# Altium schematic sheet STB_LightBoard.SchDoc: STB Light Board
size A3; Author: mayerph; DrawnBy: mayerph; Organization: PBL; Revision: A; SheetNumber: 1; SheetTotal: 21
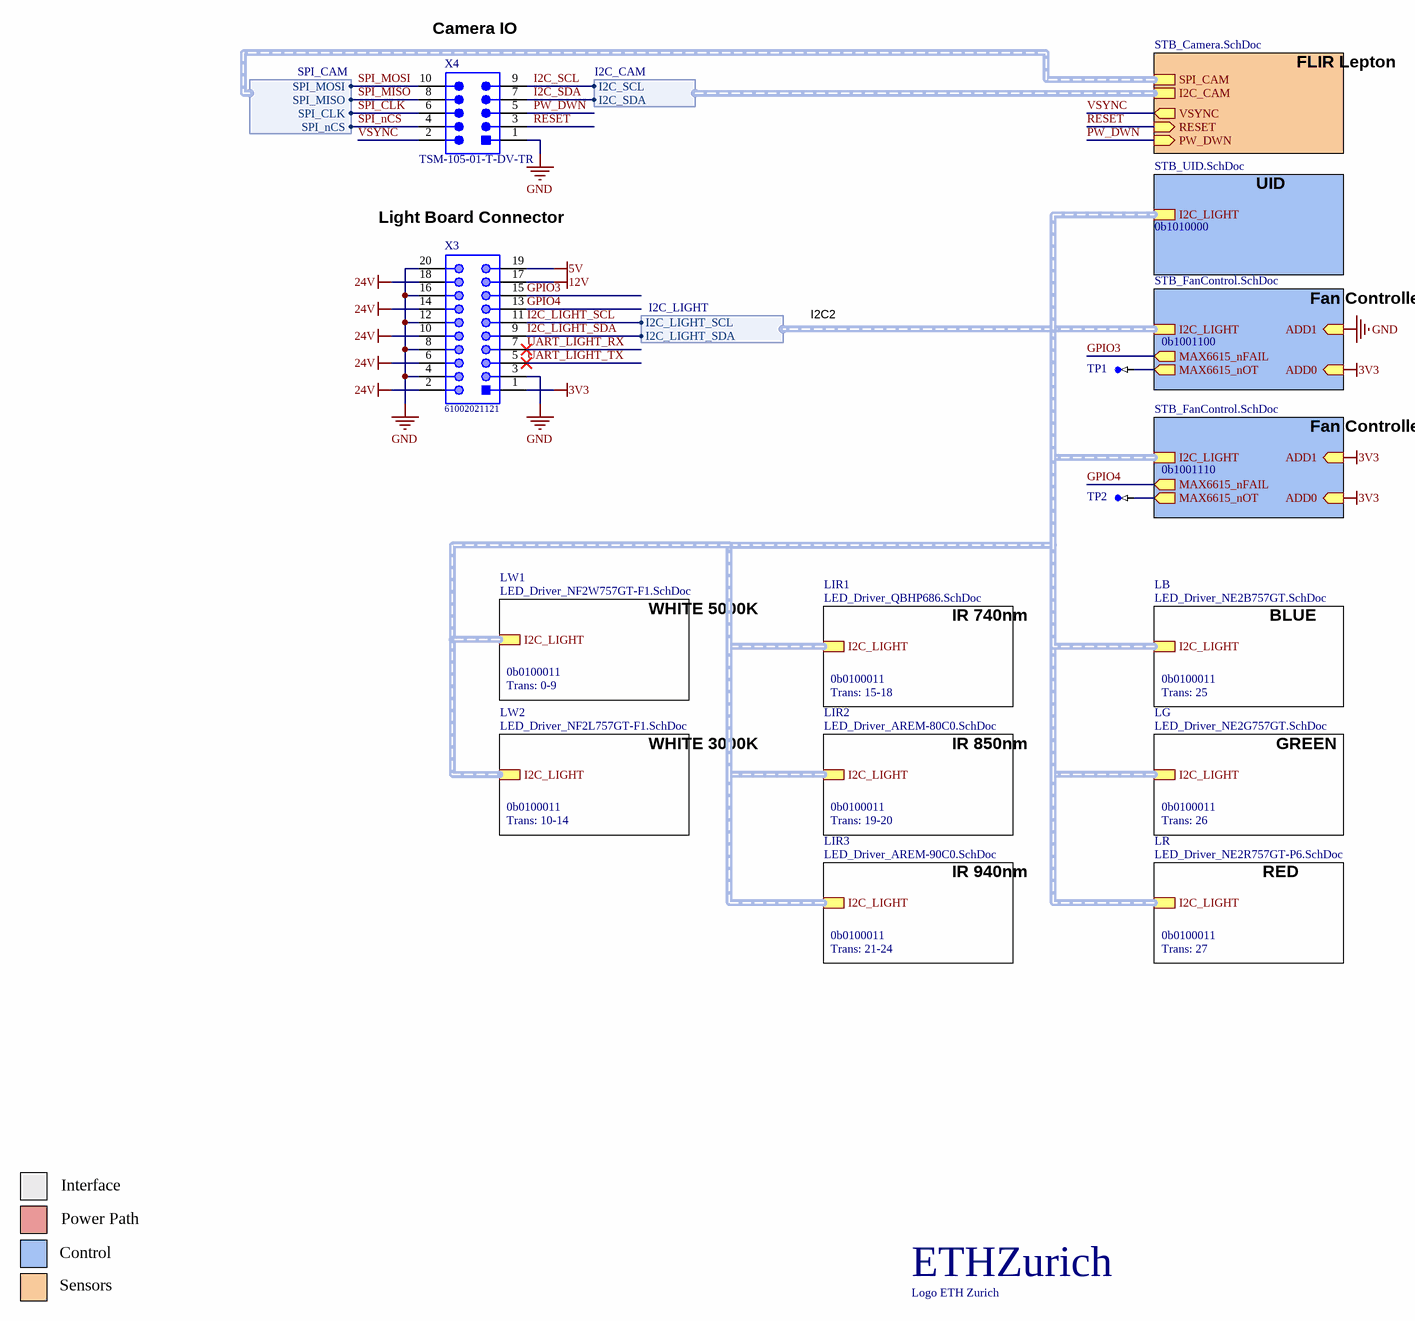
[diagram p0: STB_LightBoard.SchDoc]

## Parts
A1  Logo ETH Zurich  [eth-zurich_5mm]  (no BOM)
TP1  testPoint_1mm  [TP-SM-C-100]  (value not drawn)  (no BOM)
TP2  testPoint_1mm  [TP-SM-C-100]  (value not drawn)  (no BOM)
X3  61002021121  [61002021121]
X4  TSM-105-01-T-DV-TR  [SMTC-TSM-105-01-T-DV_V]

## Sub-sheets
FLIR = STB_Camera.SchDoc: PW_DWN (in), RESET (in), VSYNC (out), I2C_CAM (harness I2C_CAM), SPI_CAM (harness SPI_CAM)
LB = LED_Driver_NE2B757GT.SchDoc: I2C_LIGHT (harness I2C_LIGHT)
LG = LED_Driver_NE2G757GT.SchDoc: I2C_LIGHT (harness I2C_LIGHT)
LIR1 = LED_Driver_QBHP686.SchDoc: I2C_LIGHT (harness I2C_LIGHT)
LIR2 = LED_Driver_AREM-80C0.SchDoc: I2C_LIGHT (harness I2C_LIGHT)
LIR3 = LED_Driver_AREM-90C0.SchDoc: I2C_LIGHT (harness I2C_LIGHT)
LR = LED_Driver_NE2R757GT-P6.SchDoc: I2C_LIGHT (harness I2C_LIGHT)
LW1 = LED_Driver_NF2W757GT-F1.SchDoc: I2C_LIGHT (harness I2C_LIGHT)
LW2 = LED_Driver_NF2L757GT-F1.SchDoc: I2C_LIGHT (harness I2C_LIGHT)
TC1 = STB_FanControl.SchDoc: MAX6615_nOT (out), MAX6615_nFAIL (out), I2C_LIGHT (harness I2C_LIGHT), ADD1 (in), ADD0 (in)
TC2 = STB_FanControl.SchDoc: MAX6615_nOT (out), MAX6615_nFAIL (out), I2C_LIGHT (harness I2C_LIGHT), ADD1 (in), ADD0 (in)
UID = STB_UID.SchDoc: I2C_LIGHT (harness I2C_LIGHT)

## Harnesses
I2C_LIGHT: I2C_LIGHT_SDA, I2C_LIGHT_SCL
I2C_CAM: I2C_SDA, I2C_SCL
SPI_CAM: SPI_MISO, SPI_MOSI, SPI_CLK, SPI_nCS

## Nets
3V3: X3.1 ; sheet TC1/ADD0, sheet TC2/ADD1, sheet TC2/ADD0
5V: X3.19
12V: X3.17
24V: X3.2 X3.6 X3.10 X3.14 X3.18
GND: X3.3 X3.4 X3.8 X3.12 X3.16 X3.20 X4.1 ; sheet TC1/ADD1
GPIO3: X3.15 ; sheet TC1/MAX6615_nFAIL
GPIO4: X3.13 ; sheet TC2/MAX6615_nFAIL
I2C_LIGHT_SCL: X3.11 ; sheet UID/I2C_LIGHT.I2C_LIGHT_SCL
I2C_LIGHT_SDA: X3.9 ; sheet UID/I2C_LIGHT.I2C_LIGHT_SDA
I2C_SCL: X4.9 ; sheet FLIR/I2C_CAM.I2C_SCL
I2C_SDA: X4.7 ; sheet FLIR/I2C_CAM.I2C_SDA
PW_DWN: X4.5 ; sheet FLIR/PW_DWN
RESET: X4.3 ; sheet FLIR/RESET
SPI_CLK: X4.6 ; sheet FLIR/SPI_CAM.SPI_CLK
SPI_MISO: X4.8 ; sheet FLIR/SPI_CAM.SPI_MISO
SPI_MOSI: X4.10 ; sheet FLIR/SPI_CAM.SPI_MOSI
SPI_nCS: X4.4 ; sheet FLIR/SPI_CAM.SPI_nCS
UART_LIGHT_RX: X3.7
UART_LIGHT_TX: X3.5
VSYNC: X4.2 ; sheet FLIR/VSYNC
NetTP1_TP: TP1.TP ; sheet TC1/MAX6615_nOT
NetTP2_TP: TP2.TP ; sheet TC2/MAX6615_nOT

## Buses and harness runs
harness sheet LB/I2C_LIGHT = sheet LG/I2C_LIGHT = sheet LIR1/I2C_LIGHT = sheet LIR2/I2C_LIGHT = sheet LIR3/I2C_LIGHT = sheet LR/I2C_LIGHT = sheet LW1/I2C_LIGHT = sheet LW2/I2C_LIGHT = sheet TC1/I2C_LIGHT = sheet TC2/I2C_LIGHT = sheet UID/I2C_LIGHT

## Notes on the sheet
- (near X4) Camera IO
- FLIR Lepton
- (near X3) Light Board Connector
- 0b1010000
- UID
- Fan Controller 1
- I2C2
- (near TP1) 0b1001100
- Fan Controller 2
- (near TP2) 0b1001110
- WHITE 5000K
- IR 740nm
- BLUE
- 0b0100011
- Trans: 0-9
- Trans: 15-18
- Trans: 25
- WHITE 3000K
- IR 850nm
- GREEN
- Trans: 10-14
- Trans: 19-20
- Trans: 26
- IR 940nm
- RED
- Trans: 21-24
- Trans: 27
- Interface
- Power Path
- Control
- Sensors
- 1
- 2
- 3
- 4
- 5
- 6
- 7
- 8
- A
- B
- C
- D
- Project:
- Date:
- Drawing number:
- Rev:
- Format:
- A3
- Drawn by:
- Laboratory:
- Page
- Sheet:
- of
- File:
- (in symbol CMP-00038-1) ETHZurich

## Library data of the parts
A1 = CMP-00038-1
TP1 TP2 = testPoint_1mm: testPoint 1mm
X3 = CMP-1502-01036-1: SMT Vertical Pin Header WR-PHD, Pitch 2.54 mm, Dual Row, 20 pins; Manufacturer: Wurth Elektronik; Manufacturer Series: 6100; Pin Number: 20; Gender: Male; Rated Current: 3A; Working Voltage: 250VAC; Pitch: 2.54mm; Contact Resistance: 20mOhm; Withstanding Voltage: 500VAC; Connector Type: BOARD CONNECTOR; Option: General Purpose; Filter Feature: No; Body/Shell Style: RECEPTACLE; Number of Rows Loaded: 2; Contact Pattern: RECTANGULAR; Contact Style: SQ PIN-SKT; Number Of Connectors: 1; Dielectric Withstanding Voltage (AC): 500V; Insulation Resistance: 1GR; Mating Contact Pitch: 0.1inch; Body Breadth: 0.2inch; Body Depth: 0.142inch; Body Length: 1inch; Mounting Option 1: LOCKING; PCB Contact Row Spacing: 5.4102mm; Reference Standard: UL; Reliability: COMMERCIAL; Package Reference: 61002021121; Part Number: 61002021121; Datasheet URL: https://katalog.we-online.de/em/datasheet/6100xx21121.pdf; Mounting Technology: SMT; Orientation: Vertical; Row Number: Dual; Publisher: WurthElektronik; Packaging: Tube; Manufacturer URL: http://www.we-online.de; Operating Temperature: -40to125degC; Supplier 1: Digi-Key; Supplier Part Number 1: 732-5468-5-ND; Manufacturer Part Number: 61002021121; RoHS: Yes; Category: Connectors; Stock 1: 578; Pricing 1: 1=3.72000, 10=3.15900, 24=2.63208, 48=2.19292, 96=1.99302, 192=1.81302 (USD); Mount: Board; Contact Material: Copper Alloy; Contact Finish - Mating: GOLD; Contact Finish - Termination: Gold (Au) - with Nickel (Ni) barrier; Insulation Material: Polyamide; Insulation Color: Black; Min Operating Temperature: -40°C; Max Operating Temperature: 125°C; JESD-609 Code: e4; Contact Gender: Male; Mixed Contacts: No; Termination: SMD/SMT; Number of Contacts: 20; Mounting Style: STRAIGHT; Number Of PCB Rows: 2; PCB Contact Pattern: RECTANGULAR; Rated Current (Signal): 3A; Terminal Pitch: 2.54mm; Mating Contact Row Spacing: 0.1inch; Flammability Rating: UL94 V-0; REACH SVHC: Yes; RoHS Compliant: Yes; DIN Conformance: No; IEC Conformance: No; MIL Conformance: No; ComponentLink1URL: https://datasheet.ciiva.com:443/pdfs/VipMasterIC/IC/MIDC/MIDCS04347/MIDCS04347-1.pdf?src-supplier=IHS+Markit; ComponentLink1Description: https://datasheet.ciiva.com:443/pdfs/VipMasterIC/IC/MIDC/MIDCS04347/MIDCS04347-1.pdf?src-supplier=IHS+Markit; ComponentLink2URL: https://katalog.we-online.de/em/datasheet/6100xx21121.pdf?src-supplier=Digi-Key; ComponentLink2Description: https://katalog.we-online.de/em/datasheet/6100xx21121.pdf?src-supplier=Digi-Key; ComponentLink3URL: http://www.farnell.com/cad/1737271.pdf?src-supplier=Element14; ComponentLink3Description: http://www.farnell.com/cad/1737271.pdf?src-supplier=Element14
X4 = CMP-1707-00003-3: Male Header, Pitch 2.54 mm, 2 x 5 Position, Height 9.65 mm, -55 to 105 degC, RoHS, Tape and Reel; Manufacturer: Samtec; Manufacturer Series: TSM; Description: Board Connector, 10 Contact(s), 2 Row(s), Male, Straight, 0.1 inch Pitch, Surface Mount Terminal, Locking, Black Insulator, Receptacle; Connector Type: BOARD CONNECTOR; Option: General Purpose; Body/Shell Style: RECEPTACLE; Filter Feature: No; Number of Rows Loaded: 2; Number of Contacts: 10; Mating Information: MULTIPLE MATING PARTS AVAILABLE; Contact Pattern: RECTANGULAR; Contact Style: SQ PIN-SKT; Number Of Connectors: 1; Body Breadth: 0.2inch; Mating Contact Pitch: 0.1inch; Mounting Option 1: LOCKING; Reference Standard: UL; Reliability: COMMERCIAL; Max Operating Temperature: 105 degC; ComponentLink1URL: http://www.samtec.com/; Min Operating Temperature: -55 degC; ComponentLink2URL: http://suddendocs.samtec.com/catalog_english/tsm.pdf; ComponentLink2Description: Datasheet; Mounting Technology: Surface Mount; Pins: 10; DatasheetVersion: Rev. 31DEC15; PackageDescription: Male Header, Pitch 2.54 mm, 2 x 5 Position, Height 9.65 mm; Height: 9.65 mm; ComponentLink3URL: http://suddendocs.samtec.com/prints/tsm-dv-footprint.pdf; Packaging: Tape and Reel; Radiation Hardening: No; ComponentLink3Description: Package Specification; RoHSCompliant: True; REACH SVHC: No SVHC; Length: 12.7 mm; PartNumber: TSM-105-01-T-DV-TR; Mount: Surface Mount; ComponentLink1Description: Manufacturer URL; Supplier 1: Digi-Key; Supplier Part Number 1: SAM15490DKR-ND; Manufacturer Part Number: TSM-105-01-T-DV-TR; RoHS: Yes; Category: Headers and Wire Housings; Stock 1: 302; Pricing 1: 1=1.29000, 10=1.08900, 100=0.97770 (USD); Contact Finish - Mating: MATTE TIN OVER NICKEL (50); Contact Finish - Termination: Tin (Sn) - with Nickel (Ni) barrier; Contact Material: Bronze; Insulation Material: Polymer; Insulation Color: Black; JESD-609 Code: e3; Contact Gender: Male; Mixed Contacts: No; Mounting Style: STRAIGHT; Termination: SMD/SMT; Number Of PCB Rows: 2; PCB Contact Pattern: RECTANGULAR; Terminal Pitch: 2.54mm; Mating Contact Row Spacing: 0.1inch; DIN Conformance: No; IEC Conformance: No; MIL Conformance: No; Reach SVHC Compliant: Yes; RoHS Compliant: Yes; ComponentLink4URL: https://datasheet.ciiva.com:443/pdfs/VipMasterIC/IC/SAMI/SAMI-S-A0001470581/SAMI-S-A0001470581-1.pdf?src-supplier=IHS+Markit; ComponentLink4Description: https://datasheet.ciiva.com:443/pdfs/VipMasterIC/IC/SAMI/SAMI-S-A0001470581/SAMI-S-A0001470581-1.pdf?src-supplier=IHS+Markit; ComponentLink5URL: http://www.farnell.com/datasheets/2186767.pdf?src-supplier=Farnell; ComponentLink5Description: http://www.farnell.com/datasheets/2186767.pdf?src-supplier=Farnell; ComponentLink6URL: http://components.arrow.com/part/dataview/2684870S6011475N1004?src-supplier=Arrow+Electronics; ComponentLink6Description: http://components.arrow.com/part/dataview/2684870S6011475N1004?src-supplier=Arrow+Electronics; ComponentLink7URL: http://suddendocs.samtec.com/prints/tsm-1xx-xx-xxx-xx-x-xxx-x-mkt.pdf?src-supplier=Digi-Key; ComponentLink7Description: http://suddendocs.samtec.com/prints/tsm-1xx-xx-xxx-xx-x-xxx-x-mkt.pdf?src-supplier=Digi-Key; ComponentLink8URL: http://www.samtec.com/documents/webfiles/pdf/TSM.PDF?src-supplier=Avnet; ComponentLink8Description: http://www.samtec.com/documents/webfiles/pdf/TSM.PDF?src-supplier=Avnet